# EAGLE design untitled (EAGLE 5.06)
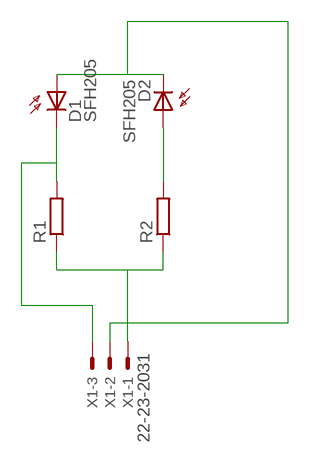
[diagram p0: schematic, sheet 1]

## Parts
D1  SFH205  [SFH205]
D2  SFH205  [SFH205]
R1  R-EU_0207/10  [0207/10]
R2  R-EU_0207/10  [0207/10]
X1  22-23-2031  [22-23-2031]

## Nets
N$1: R1.1 R2.1 X1.1
N$2: D1.K(C) R1.2 X1.3
N$3: D1.A D2.K(C) X1.2
N$4: D2.A R2.2

## Library data of the parts
D1 D2 = opto-trans-siemens:SFH205: PHOTO DIODE
R1 R2 = rcl:R-EU_: RESISTOR, European symbol
X1 = con-molex:22-23-2031: .100" (2.54mm) Center Header - 3 Pin

## Board
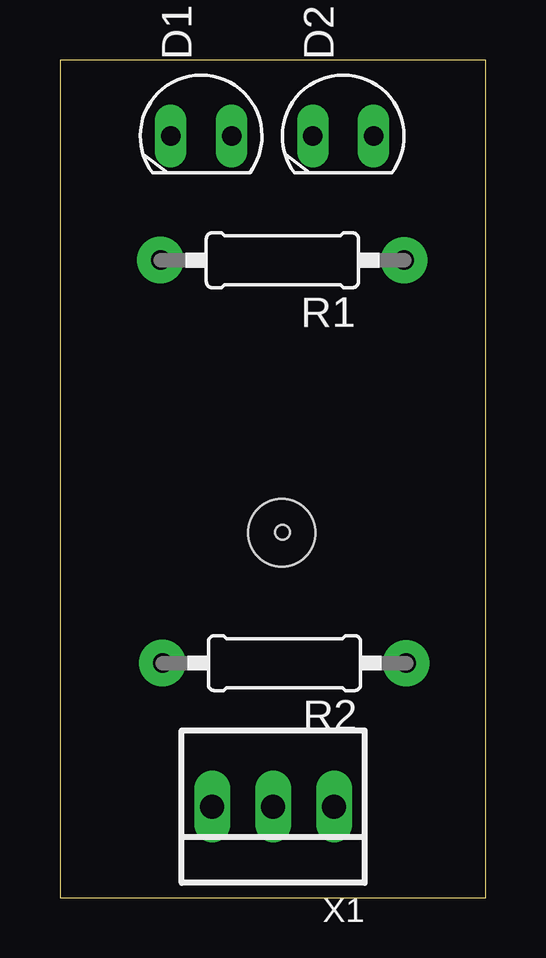
[diagram p1: board, top side]
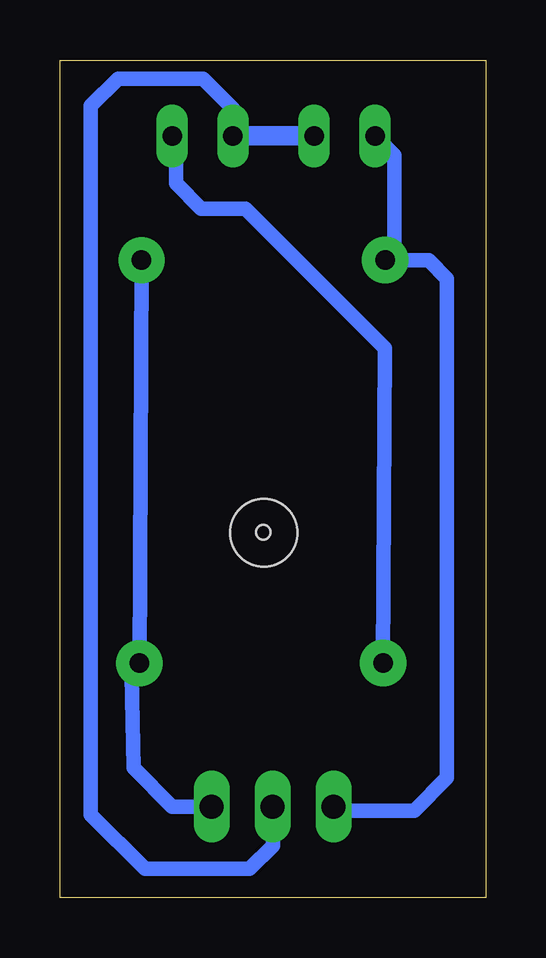
[diagram p2: board, bottom side, seen from below]

Size 17.76 x 34.92 mm. Coordinates in mm from the lower left corner, seen from the top.
Outline: 0,0 17.76,0 17.76,34.92 0,34.92 0,0
Copper layers (1*16): Top 0.035mm / dielectric 1.5mm / Bottom 0.035mm
Design rules "default": minimum track width 10mil, minimum drill 24mil, track to track 8mil, track to pad 8mil, pad to pad 8mil, via to via 8mil, smd to smd 8mil, copper to edge 40mil, drill to drill 8mil, minimum pad ring 10mil, minimum via ring 8mil, stop-mask expansion 4mil, vias tented up to drill 0mil, thermal gap 10mil
Holes 0.6 mm at 9.28,15.24
Holes 2.8 mm at 9.26,15.22

### Footprints (pad centres in the part's own frame; a part is rotated, then mirrored left to right if it is on the bottom)
SFH205 = drill 0.813 long: A 0,-1.27; K 0,1.27
0207/10 = drill 0.813 octagon: 1 -5.08,0; 2 5.08,0
22-23-2031 = drill 1 long: 1 -2.54,0; 2 0,0; 3 2.54,0

### Placement (x,y rotation side)
D1  5.89,31.75 90 top
D2  11.81,31.75 90 top
R1  9.28,26.57 180 top
R2  9.37,9.79 180 top
X1  8.89,3.81 180 top

### Tracks (layer width: path | path; a pad name or v marks a point on that pad's centre or on a via)
N$1
  Bottom 0.61: X1.1 13.09,3.81 14.7,5.42 14.77,9.26 | 14.77,9.26 14.77,9.46 R2.1 | R1.1 14.44,9.6 14.77,9.26
N$2
  Bottom 0.61: X1.3 6.18,3.64 2.99,3.64 1.61,5.01 1.61,25.81 2.38,26.57 R1.2 3.81,26.96 3.81,30.94 D1.K
N$3
  Bottom 0.61: D2.K 10.54,32.89 11.79,34.14 15.34,34.14 16.47,33.01 16.47,3.47 14.21,1.21 9.85,1.21 8.88,2.18 X1.2
  Bottom 0.813: D1.A D2.K
N$4
  Bottom 0.61: R2.2 4.21,22.91 5.97,24.67 5.97,24.68 10.01,28.72 11.87,28.72 12.92,29.77 12.92,31.59 D2.A
N$5  (via drill 0.8 pad 1.93)
  other vias: 4.19,26.59
N$6  (via drill 0.8 pad 1.93)
  other vias: 14.36,26.58
N$7  (via drill 0.8 pad 1.93)
  other vias: 14.44,9.78
N$8  (via drill 0.8 pad 1.93)
  other vias: 4.28,9.79